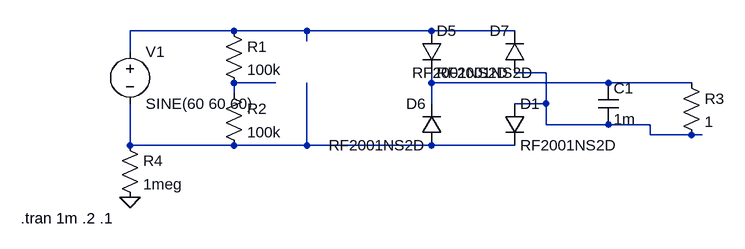
[diagram p0: schematic dv-dc-supply.asc]
dv-dc-supply.asc, the LTspice schematic file:
Version 4
SHEET 1 1076 680
WIRE 304 160 144 160
WIRE 416 160 304 160
WIRE 608 160 416 160
WIRE 736 160 608 160
WIRE 416 176 416 160
WIRE 144 192 144 160
WIRE 784 224 736 224
WIRE 368 240 304 240
WIRE 608 240 608 224
WIRE 880 240 608 240
WIRE 1008 240 880 240
WIRE 304 256 304 240
WIRE 608 272 608 240
WIRE 784 272 784 224
WIRE 784 272 736 272
WIRE 784 304 784 272
WIRE 880 304 784 304
WIRE 944 304 880 304
WIRE 944 320 944 304
WIRE 1008 320 944 320
WIRE 1024 320 1008 320
WIRE 144 336 144 272
WIRE 304 336 144 336
WIRE 416 336 416 240
WIRE 416 336 304 336
WIRE 608 336 416 336
WIRE 736 336 608 336
FLAG 144 416 0
SYMBOL voltage 144 176 R0
SYMATTR InstName V1
SYMATTR Value SINE(60 60 60)
SYMBOL res 288 144 R0
SYMATTR InstName R1
SYMATTR Value 100k
SYMBOL res 288 240 R0
SYMATTR InstName R2
SYMATTR Value 100k
SYMBOL diode 720 272 R0
SYMATTR InstName D1
SYMATTR Value RF2001NS2D
SYMBOL cap 864 240 R0
SYMATTR InstName C1
SYMATTR Value 1m
SYMATTR SpiceLine Rser=1
SYMBOL diode 592 160 R0
SYMATTR InstName D5
SYMATTR Value RF2001NS2D
SYMBOL diode 624 336 R180
WINDOW 0 24 64 Left 2
WINDOW 3 24 0 Left 2
SYMATTR InstName D6
SYMATTR Value RF2001NS2D
SYMBOL diode 752 224 R180
WINDOW 0 24 64 Left 2
WINDOW 3 24 0 Left 2
SYMATTR InstName D7
SYMATTR Value RF2001NS2D
SYMBOL res 992 224 R0
SYMATTR InstName R3
SYMATTR Value 1
SYMBOL res 128 320 R0
SYMATTR InstName R4
SYMATTR Value 1meg
TEXT -24 448 Left 2 !.tran 1m .2 .1

The netlist it stands for:
* dv-dc-supply.asc
V1 N001 N005 SINE(60 60 60)
R1 N001 N003 100k
R2 N003 N005 100k
D1 N002 N005 RF2001NS2D
C1 N004 N002 1m Rser=1
D5 N001 N004 RF2001NS2D
D6 N005 N004 RF2001NS2D
D7 N002 N001 RF2001NS2D
R3 N004 N002 1
R4 N005 0 1meg
.model D D
.lib standard.dio
.tran 1m .2 .1
.backanno
.end